# Altium project Kill_Board.PrjPcb
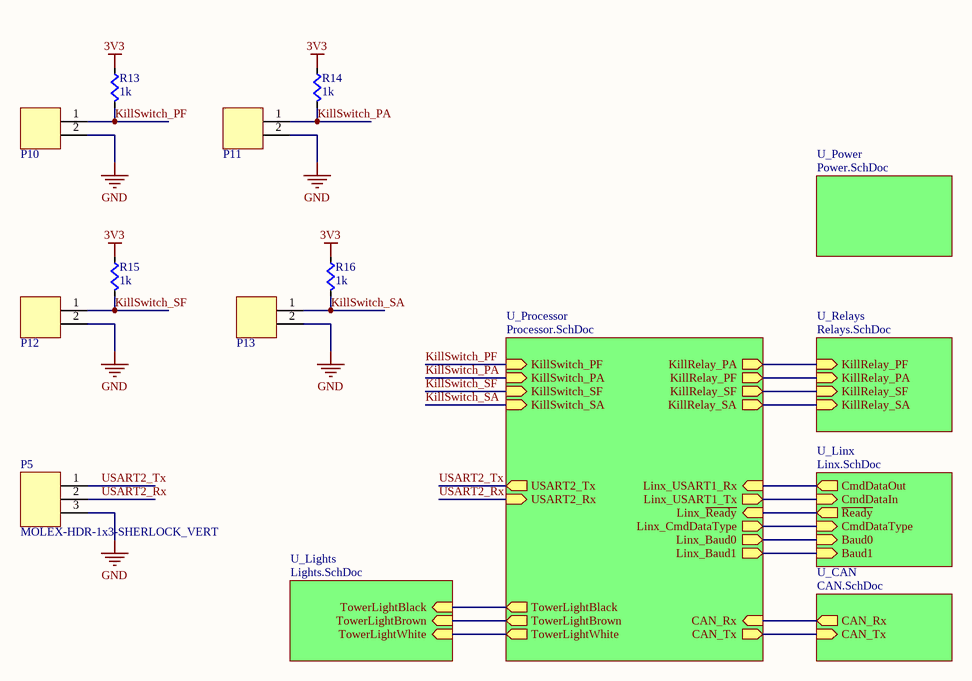
[diagram p0: Kill_Board_Top.SchDoc]
7 sheets, 86 parts. Net scope: hierarchical (ports join the sheet entries above them; power ports are global).
Board file: Kill_Board.PcbDoc
Sheets:
  Kill_Board_Top.SchDoc
    U_Processor = Processor.SchDoc
    U_Lights = Lights.SchDoc
    U_Power = Power.SchDoc
    U_CAN = CAN.SchDoc
    U_Relays = Relays.SchDoc
    U_Linx = Linx.SchDoc

## Sheet Kill_Board_Top.SchDoc
size A

### Parts
P5  MOLEX-HDR-1x3-SHERLOCK_VERT  [MOLEX-HDR-1X3-SHERLOCK-VERT]
P10  2-pin Horz Sherlock  [MOLEX-HDR-1X2-SHERLOCK-HORZ]  (value not drawn)
P11  2-pin Horz Sherlock  [MOLEX-HDR-1X2-SHERLOCK-HORZ]  (value not drawn)
P12  2-pin Horz Sherlock  [MOLEX-HDR-1X2-SHERLOCK-HORZ]  (value not drawn)
P13  2-pin Horz Sherlock  [MOLEX-HDR-1X2-SHERLOCK-HORZ]  (value not drawn)
R13  value 1k  [RES0603]  (hidden comment: Res)
R14  value 1k  [RES0603]  (hidden comment: Res)
R15  value 1k  [RES0603]  (hidden comment: Res)
R16  value 1k  [RES0603]  (hidden comment: Res)

### Sub-sheets
U_CAN = CAN.SchDoc: CAN_Rx (out), CAN_Tx (in)
U_Lights = Lights.SchDoc: TowerLightWhite (in), TowerLightBrown (in), TowerLightBlack (in)
U_Linx = Linx.SchDoc: ~{Ready} (out), CmdDataType (in), CmdDataOut (out), CmdDataIn (in), Baud0 (in), Baud1 (in)
U_Power = Power.SchDoc: no entries
U_Processor = Processor.SchDoc: KillSwitch_PF (in), TowerLightWhite (out), Linx_Baud1 (out), KillSwitch_PA (in), KillSwitch_SF (in), KillSwitch_SA (in), Linx_Baud0 (out), TowerLightBrown (out), TowerLightBlack (out), KillRelay_PF (out), KillRelay_PA (out), KillRelay_SF (out), KillRelay_SA (out), USART2_Rx (in), USART2_Tx (out), Linx_USART1_Rx (in), Linx_USART1_Tx (out), CAN_Rx (in), CAN_Tx (out), Linx_CmdDataType (out), Linx_~{Ready} (in)
U_Relays = Relays.SchDoc: KillRelay_PF (in), KillRelay_PA (in), KillRelay_SF (in), KillRelay_SA (in)

### Nets
3V3: R13.2(B) R14.2(B) R15.2(B) R16.2(B)
GND: P5.3 P10.2 P11.2 P12.2 P13.2
KillSwitch_PA: P11.1 R14.1(A) ; sheet U_Processor/KillSwitch_PA
KillSwitch_PF: P10.1 R13.1(A) ; sheet U_Processor/KillSwitch_PF
KillSwitch_SA: P13.1 R16.1(A) ; sheet U_Processor/KillSwitch_SA
KillSwitch_SF: P12.1 R15.1(A) ; sheet U_Processor/KillSwitch_SF
USART2_Rx: P5.2 ; sheet U_Processor/USART2_Rx
USART2_Tx: P5.1 ; sheet U_Processor/USART2_Tx
NetR1_1: sheet U_Processor/TowerLightBlack, sheet U_Lights/TowerLightBlack
NetR2_1: sheet U_Processor/TowerLightBrown, sheet U_Lights/TowerLightBrown
NetR3_1: sheet U_Processor/TowerLightWhite, sheet U_Lights/TowerLightWhite
NetR17_1: sheet U_Processor/KillRelay_PA, sheet U_Relays/KillRelay_PF
NetR18_1: sheet U_Processor/KillRelay_PF, sheet U_Relays/KillRelay_PA
NetR19_1: sheet U_Processor/KillRelay_SF, sheet U_Relays/KillRelay_SF
NetR20_1: sheet U_Processor/KillRelay_SA, sheet U_Relays/KillRelay_SA
NetU1_1: sheet U_Processor/CAN_Rx, sheet U_CAN/CAN_Rx
NetU1_4: sheet U_Processor/CAN_Tx, sheet U_CAN/CAN_Tx
NetU4_30: sheet U_Processor/Linx_USART1_Tx, sheet U_Linx/CmdDataIn
NetU4_31: sheet U_Processor/Linx_USART1_Rx, sheet U_Linx/CmdDataOut
NetU4_40: sheet U_Processor/Linx_~{Ready}, sheet U_Linx/~{Ready}
NetU4_41: sheet U_Processor/Linx_CmdDataType, sheet U_Linx/CmdDataType
NetU4_42: sheet U_Processor/Linx_Baud0, sheet U_Linx/Baud0
NetU4_43: sheet U_Processor/Linx_Baud1, sheet U_Linx/Baud1

### Library data of the parts
P5 = MOLEX-HDR-1x3-SHERLOCK_VERT: Header, Molex, 2mm Pitch Sherlock Header, Single Row, Vertical, 3 Circuits, Length 3.3mm, 0353620376; Supplier 1: Digi-Key; Supplier Part Number 1: WM18921-ND
P10-P13 = MOLEX-HDR-1x2-SHERLOCK_RA: Header, Molex, 2mm Pitch Sherlock Header, Single Row, Horizontal, 2 Circuits, Length 3.3mm,  0353630260; Manufacturer: Molex Inc; Manufacturer Part Number: 0353630260; Supplier Part Number 1: WM18931-ND; Supplier 1: Digi-Key
R13-R16 = Res: Supplier 1: Digi-Key; Supplier Part Number 1: RMCF0603JT10K0CT-ND

## Sheet Processor.SchDoc
size A
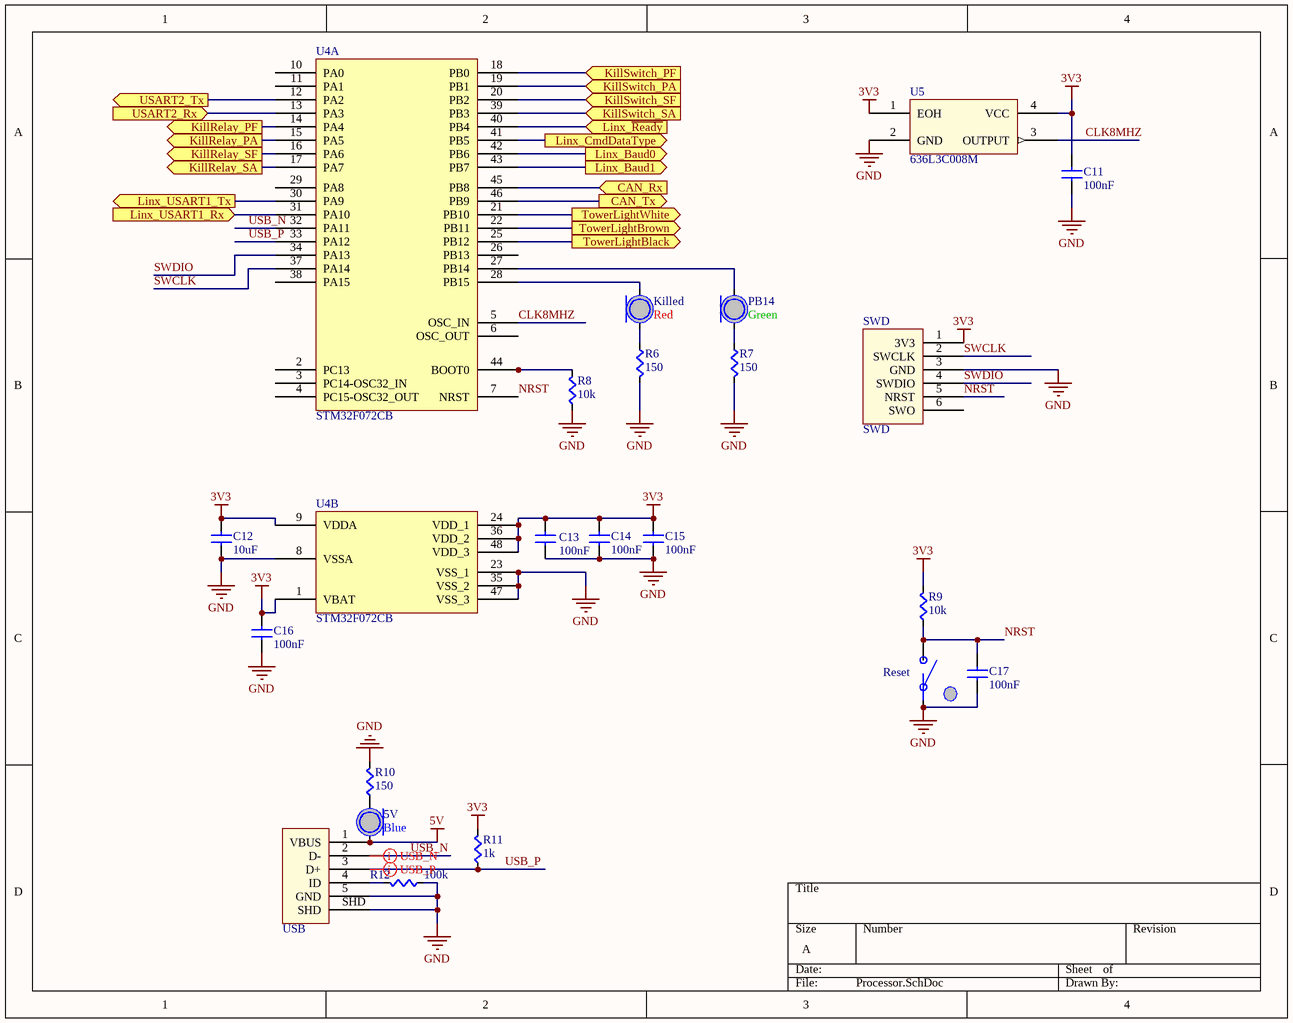
[diagram p1: Processor.SchDoc]

### Parts
5V  Color: Blue  [LED0603]  (hidden comment: LED)
C11  value 100nF  [CAPC0603]  (hidden comment: Cap)
C12  value 10uF  [CAPC0603]  (hidden comment: Cap)
C13  value 100nF  [CAPC0603]  (hidden comment: Cap)
C14  value 100nF  [CAPC0603]  (hidden comment: Cap)
C15  value 100nF  [CAPC0603]  (hidden comment: Cap)
C16  value 100nF  [CAPC0603]  (hidden comment: Cap)
C17  value 100nF  [CAPC0603]  (hidden comment: Cap)
Killed  Color: Red  [LED0603]  (hidden comment: LED)
PB14  Color: Green  [LED0603]  (hidden comment: LED)
R6  value 150  [RES0603]  (hidden comment: Res)
R7  value 150  [RES0603]  (hidden comment: Res)
R8  value 10k  [RES0603]  (hidden comment: Res)
R9  value 10k  [RES0603]  (hidden comment: Res)
R10  value 150  [RES0603]  (hidden comment: Res)
R11  value 1k  [RES0603]  (hidden comment: Res)
R12  value 100k  [RES0603]  (hidden comment: Res)
Reset  Button  [PTS645xxxxSMTR92]  (value not drawn)
SWD  SWD  [SWD_STM32]
U4  STM32F072CB  [STM32F072CB]  (parts A,B of 2)
U5  636L3C008M  [636L3C]
USB  USB Micro  [10118192-0001LF]  (value not drawn)

### Ports
CAN_Rx (in), CAN_Tx (out), KillRelay_PA (out), KillRelay_PF (out), KillRelay_SA (out), KillRelay_SF (out), KillSwitch_PA (in), KillSwitch_PF (in), KillSwitch_SA (in), KillSwitch_SF (in), Linx_Baud0 (out), Linx_Baud1 (out), Linx_CmdDataType (out), Linx_USART1_Rx (in), Linx_USART1_Tx (out), Linx_~{Ready} (in), TowerLightBlack (out), TowerLightBrown (out), TowerLightWhite (out), USART2_Rx (in), USART2_Tx (out)

### Nets
3V3: C11.1(A) C12.2(B) C13.1(A) C14.1(A) C15.1(A) C16.1(A) R9.1(A) R11.1(A) SWD.1(3V3) U4.1(VBAT) U4.9(VDDA) U4.24(VDD_1) U4.36(VDD_2) U4.48(VDD_3) U5.1(EOH) U5.4(VCC)
5V: 5V.A USB.1(VBUS)
GND: C11.2(B) C12.1(A) C13.2(B) C14.2(B) C15.2(B) C16.2(B) C17.2(B) R6.1(A) R7.1(A) R8.2(B) R10.1(A) R12.2(B) Reset.A SWD.3(GND) U4.8(VSSA) U4.23(VSS_1) U4.35(VSS_2) U4.47(VSS_3) U5.2(GND) USB.5(GND) USB.SHD
CLK8MHZ: U4.5(OSC_IN) U5.3(OUTPUT)
KillSwitch_PA: U4.19(PB1) ; port KillSwitch_PA
KillSwitch_PF: U4.18(PB0) ; port KillSwitch_PF
KillSwitch_SA: U4.39(PB3) ; port KillSwitch_SA
KillSwitch_SF: U4.20(PB2) ; port KillSwitch_SF
NRST: C17.1(A) R9.2(B) Reset.B SWD.5(NRST) U4.7(NRST)
SWCLK: SWD.2(SWCLK) U4.37(PA14)
SWDIO: SWD.4(SWDIO) U4.34(PA13)
USART2_Rx: U4.13(PA3) ; port USART2_Rx
USART2_Tx: U4.12(PA2) ; port USART2_Tx
USB_N: U4.32(PA11) USB.2(D-)
USB_P: R11.2(B) U4.33(PA12) USB.3(D+)
Net5V_C: 5V.C R10.2(B)
NetKilled_A: Killed.A U4.28(PB15)
NetKilled_C: Killed.C R6.2(B)
NetPB14_A: PB14.A U4.27(PB14)
NetPB14_C: PB14.C R7.2(B)
NetR1_1: U4.25(PB12) ; port TowerLightBlack
NetR2_1: U4.22(PB11) ; port TowerLightBrown
NetR3_1: U4.21(PB10) ; port TowerLightWhite
NetR8_1: R8.1(A) U4.44(BOOT0)
NetR12_1: R12.1(A) USB.4(ID)
NetR17_1: U4.15(PA5) ; port KillRelay_PA
NetR18_1: U4.14(PA4) ; port KillRelay_PF
NetR19_1: U4.16(PA6) ; port KillRelay_SF
NetR20_1: U4.17(PA7) ; port KillRelay_SA
NetU1_1: U4.45(PB8) ; port CAN_Rx
NetU1_4: U4.46(PB9) ; port CAN_Tx
NetU4_30: U4.30(PA9) ; port Linx_USART1_Tx
NetU4_31: U4.31(PA10) ; port Linx_USART1_Rx
NetU4_40: U4.40(PB4) ; port Linx_~{Ready}
NetU4_41: U4.41(PB5) ; port Linx_CmdDataType
NetU4_42: U4.42(PB6) ; port Linx_Baud0
NetU4_43: U4.43(PB7) ; port Linx_Baud1

Not connected (* = marked no-connect by the designer): SWD 6(SWO); U4 2(PC13) 3(PC14-OSC32_IN) 4(PC15-OSC32_OUT) 6(OSC_OUT) 10(PA0) 11(PA1) 26(PB13) 29(PA8) 38(PA15)

### Layout directives
differential pair: USB_N, USB_P

### Library data of the parts
Reset = Button: SPST Button; Supplier 1: Digi-Key; Supplier Part Number 1: CKN9087CT-ND
SWD = SWD_STM32: SWD connector matching the pinout on STM Discovery Boards
U4 = STM32F072CB: MCU 32BIT 128KB FLASH 48LQFP; Supplier 1: Digi-Key; Supplier Part Number 1: 497-14645-ND
U5 = 636L3C: HCMOS/TTL Clock Oscillator; Supplier 1: Digi-Key; Supplier Part Number 1: CTX1005CT-ND
USB = USB Micro: USB Mini B Metal Shield SMT; Supplier 1: Digi-Key; Supplier Part Number 1: 609-4613-1-ND
5V Killed PB14 = LED: Supplier 1: Digi-Key
  5V: Supplier Part Number 1: 754-1434-1-ND
  Killed: Supplier Part Number 1: 754-1122-1-ND
  PB14: Supplier Part Number 1: 754-1116-1-ND
C11-C17 = Cap: Supplier 1: Digi-Key; Supplier Part Number 1: 1276-1000-1-ND
R6-R12 = Res: Supplier 1: Digi-Key
  R6-R10: Supplier Part Number 1: RMCF0603JT10K0CT-ND
  R11: Supplier Part Number 1: RMCF0603JT1K00CT-ND
  R12: Supplier Part Number 1: RMCF0603JT100KCT-ND

## Sheet Lights.SchDoc
size A
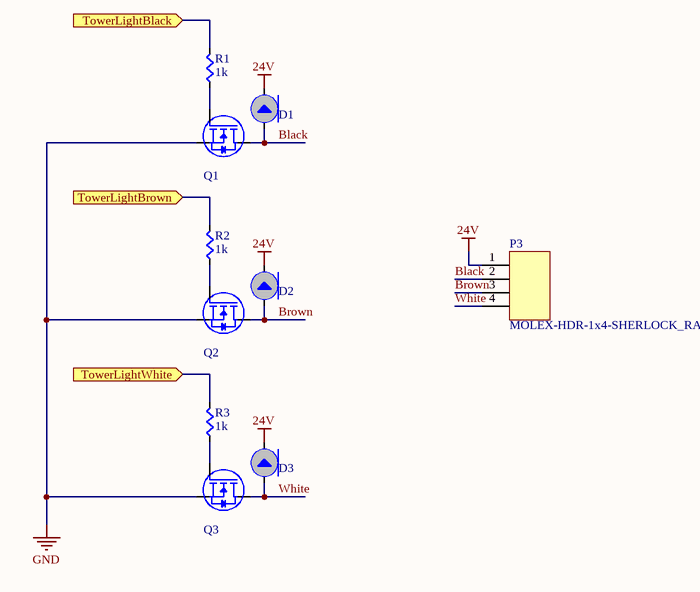
[diagram p2: Lights.SchDoc]

### Parts
D1  S1B-13-F  [SMASeries]  (value not drawn)
D2  S1B-13-F  [SMASeries]  (value not drawn)
D3  S1B-13-F  [SMASeries]  (value not drawn)
P3  MOLEX-HDR-1x4-SHERLOCK_RA  [MOLEX-HDR-1X4-SHERLOCK-RA]
Q1  BSN20-7  [SOT-323]  (value not drawn)
Q2  BSN20-7  [SOT-323]  (value not drawn)
Q3  BSN20-7  [SOT-323]  (value not drawn)
R1  value 1k  [RES0603]  (hidden comment: Res)
R2  value 1k  [RES0603]  (hidden comment: Res)
R3  value 1k  [RES0603]  (hidden comment: Res)

### Ports
TowerLightBlack (in), TowerLightBrown (in), TowerLightWhite (in)

### Nets
24V: D1.C D2.C D3.C P3.1
GND: Q1.2(S) Q2.2(S) Q3.2(S)
Black: D1.A P3.2 Q1.3(D)
Brown: D2.A P3.3 Q2.3(D)
White: D3.A P3.4 Q3.3(D)
NetQ1_1: Q1.1(G) R1.2(B)
NetQ2_1: Q2.1(G) R2.2(B)
NetQ3_1: Q3.1(G) R3.2(B)
NetR1_1: R1.1(A) ; port TowerLightBlack
NetR2_1: R2.1(A) ; port TowerLightBrown
NetR3_1: R3.1(A) ; port TowerLightWhite

### Library data of the parts
D1-D3 = Diode: Standard Diode Template; Supplier 1: Digi-Key; Supplier Part Number 1: S1B-FDICT-ND
P3 = MOLEX-HDR-1x4-SHERLOCK_RA: Header, Molex, 2mm Pitch Sherlock Header, Single Row, Horizontal, 4 Circuits, Length 3.3mm; Manufacturer Part Number: 0353630460; Supplier Part Number 1: WM18933-ND; Manufacturer: Molex; Supplier 1: Digikey
Q1-Q3 = NMOSFET: NMOSFET Template; Supplier 1: Digi-Key; Supplier Part Number 1: BSN20-7DICT-ND
R1-R3 = Res: Supplier 1: Digi-Key; Supplier Part Number 1: RMCF0603JT10K0CT-ND

## Sheet Power.SchDoc
size A
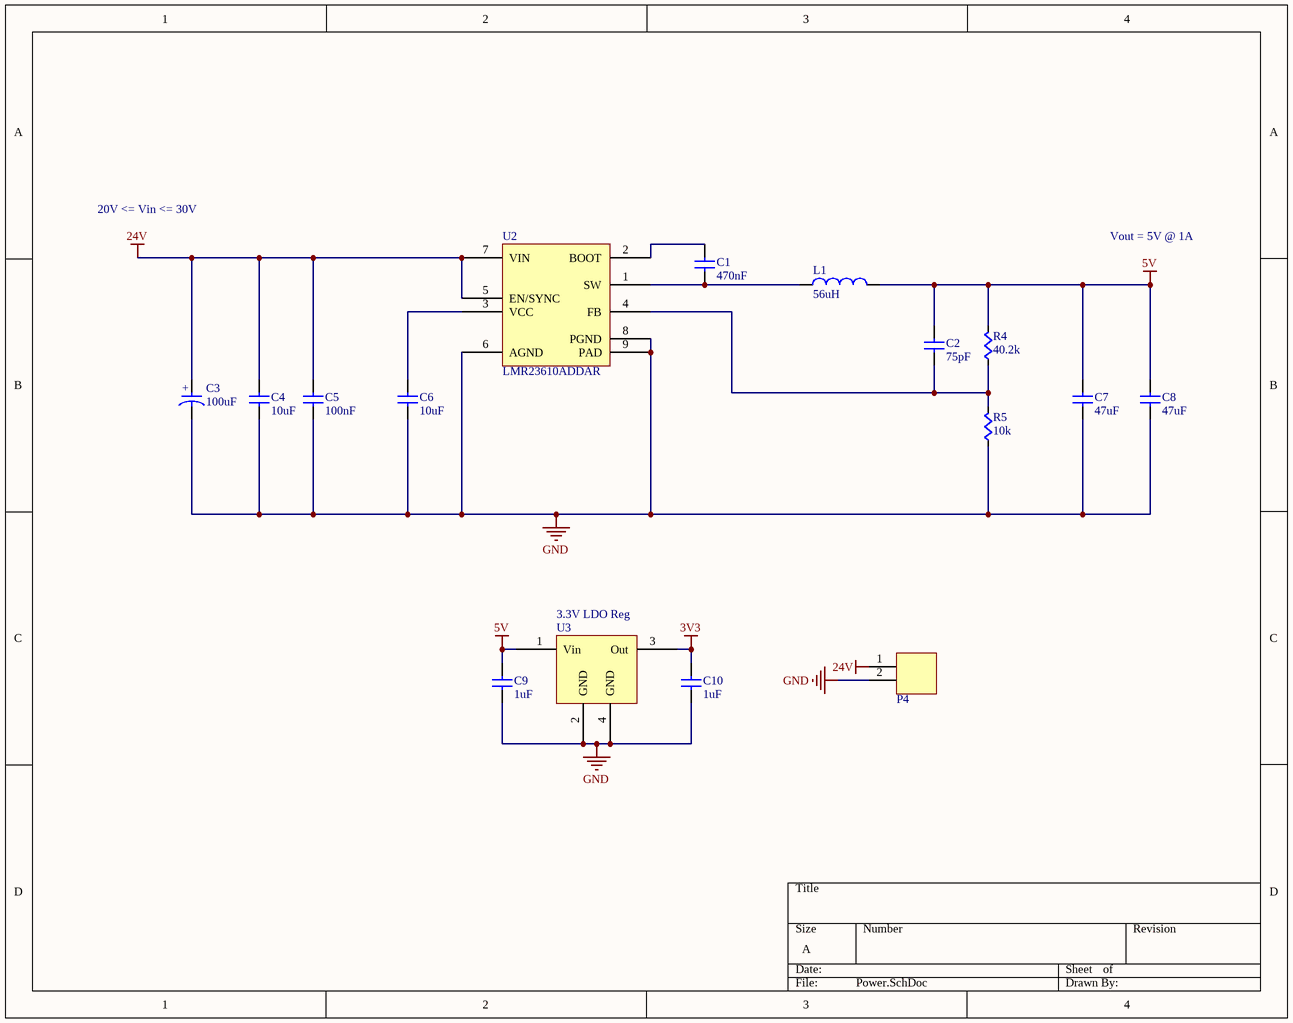
[diagram p3: Power.SchDoc]

### Parts
C1  value 470nF  [CAPC0603]  (hidden comment: Cap)
C2  value 75pF  [CAPC0603]  (hidden comment: Cap)
C3  value 100uF  [EEHZA1H101P]  (hidden comment: EEHZA1H101P)
C4  value 10uF  [CAP1210]  (hidden comment: Cap)
C5  value 100nF  [CAPC0603]  (hidden comment: Cap)
C6  value 10uF  [CAPC0603]  (hidden comment: Cap)
C7  value 47uF  [CAP1210]  (hidden comment: Cap)
C8  value 47uF  [CAP1210]  (hidden comment: Cap)
C9  value 1uF  [CAPC0603]  (hidden comment: Cap)
C10  value 1uF  [CAPC0603]  (hidden comment: Cap)
L1  value 56uH  [MSS1048-563MLB]  (hidden comment: MSS1048-563MLB)
P4  2-pin Vert Sherlock  [MOLEX-HDR-1X2-SHERLOCK-VERT]  (value not drawn)
R4  value 40.2k  [RES0603]  (hidden comment: Res)
R5  value 10k  [RES0603]  (hidden comment: Res)
U2  LMR23610ADDAR  [LMR23610ADDAR]
U3  3.3V LDO Reg  [SOT23-4n]

### Nets
3V3: C10.1(A) U3.3(Out)
5V: C2.1(A) C7.1(A) C8.1(A) C9.1(A) L1.2 R4.1(A) U3.1(Vin)
24V: C3.1 C4.1(A) C5.1(A) P4.1 U2.5(EN/SYNC) U2.7(VIN)
GND: C3.2 C4.2(B) C5.2(B) C6.2(B) C7.2(B) C8.2(B) C9.2(B) C10.2(B) P4.2 R5.2(B) U2.6(AGND) U2.8(PGND) U2.9(PAD) U3.2(GND) U3.4(GND)
NetC1_1: C1.1(A) U2.2(BOOT)
NetC1_2: C1.2(B) L1.1 U2.1(SW)
NetC2_2: C2.2(B) R4.2(B) R5.1(A) U2.4(FB)
NetC6_1: C6.1(A) U2.3(VCC)

### Notes on the sheet
- 20V <= Vin <= 30V
- Vout = 5V @ 1A
- (in symbol EEHZA1H101P) +

### Library data of the parts
C3 = EEHZA1H101P: CAP ALUM POLY HYB 100UF 50V SMD; Manufacturer 1: Panasonic; Tolerance: 20%; Supplier 1: Digi-Key; Supplier Part Number 1: P15442CT-ND; Manufacturer Part Number 1: EEHZA1H101P; Voltage: 50V; ComponentLink1URL: https://na.industrial.panasonic.com/products/capacitors/aluminum-electrolytic-capacitors/conductive-polymer-hybrid-aluminum-electrolytic/series/za-high-temp-reflow/ABA0135/model/EEHZA1H101P; ComponentLink1Description: Web Site; ComponentLink2URL: https://industrial.panasonic.com/cdbs/www-data/pdf/RDD0000/ABA0000C1221.pdf; ComponentLink2Description: Data Sheet; ComponentLink3URL: https://industrial.panasonic.com/cdbs/www-data/pdf/RDD0000/ABA0000COS44.pdf; ComponentLink3Description: ZA Series Technical Data
L1 = MSS1048-563MLB: FIXED IND 56UH 1.7A 126 MOHM; Manufacturer 1: Coilcraft; Manufacturer Part Number 1: MSS1048-563MLB; ComponentLink1Description: Web Site; ComponentLink1URL: https://www.coilcraft.com/mss1048.cfm; Supplier 1: Coilcraft; Supplier Part Number 1: MSS1048-563MLB
P4 = MOLEX-HDR-1x2-SHERLOCK_VERT: Header, Molex, 2mm Pitch Sherlock Header, Single Row, Vertical, 2 Circuits, Length 3.3mm, 0353620250; Supplier Part Number 1: WM18920-ND; Supplier 1: Digi-Key
U2 = LMR23610ADDAR: IC REG BUCK ADJ 1A SYNC 8SOPWRPD; Manufacturer 1: Texas Instruments; Supplier 1: Digi-Key; Supplier Part Number 1: 296-47267-1-ND; Manufacturer Part Number 1: LMR23610ADDAR; ComponentLink1URL: http://www.ti.com/lit/ds/symlink/lmr23610.pdf; ComponentLink1Description: Datasheet; ComponentLink2URL: http://www.ti.com/product/LMR23610/description; ComponentLink2Description: Web Site
U3 = LM3940IMPX-3.3: IC REG LDO 3.3V 1A SOT223; Supplier 1: Digi-Key; Supplier Part Number 1: LM3940IMPX-3.3/NOPBCT-ND
C1 C2 C4-C10 = Cap: Supplier 1: Digi-Key; Supplier Part Number 1: 1276-1000-1-ND
R4 R5 = Res: Supplier 1: Digi-Key; Supplier Part Number 1: RMCF0603JT10K0CT-ND

## Sheet CAN.SchDoc
size A
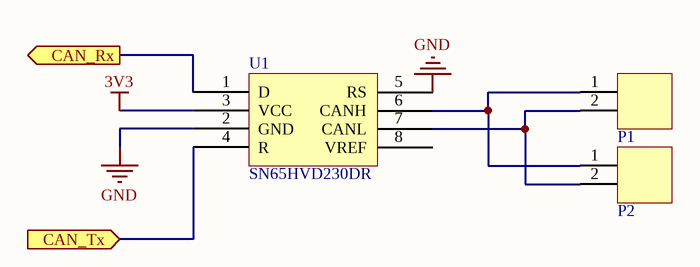
[diagram p4: CAN.SchDoc]

### Parts
P1  2-pin Horz Sherlock  [MOLEX-HDR-1X2-SHERLOCK-HORZ]  (value not drawn)
P2  2-pin Horz Sherlock  [MOLEX-HDR-1X2-SHERLOCK-HORZ]  (value not drawn)
U1  SN65HVD230DR  [SOIC-8pin]

### Ports
CAN_Rx (out), CAN_Tx (in)

### Nets
3V3: U1.3(VCC)
GND: U1.2(GND) U1.5(RS)
NetP1_1: P1.1 P2.1 U1.6(CANH)
NetP1_2: P1.2 P2.2 U1.7(CANL)
NetU1_1: U1.1(D) ; port CAN_Rx
NetU1_4: U1.4(R) ; port CAN_Tx

Not connected (* = marked no-connect by the designer): U1 8(VREF)

### Library data of the parts
P1 P2 = MOLEX-HDR-1x2-SHERLOCK_RA: as P10 on sheet Kill_Board_Top; Manufacturer Part Number: 0353630260; Supplier Part Number 1: WM18931-ND; Supplier 1: Digi-Key
U1 = SN65HVD230DR: IC TXRX CAN 1MBPS 3.3V 8SOIC; Supplier 1: Digi-Key; Supplier Part Numbe 1: 296-11654-1-ND

## Sheet Relays.SchDoc
size A
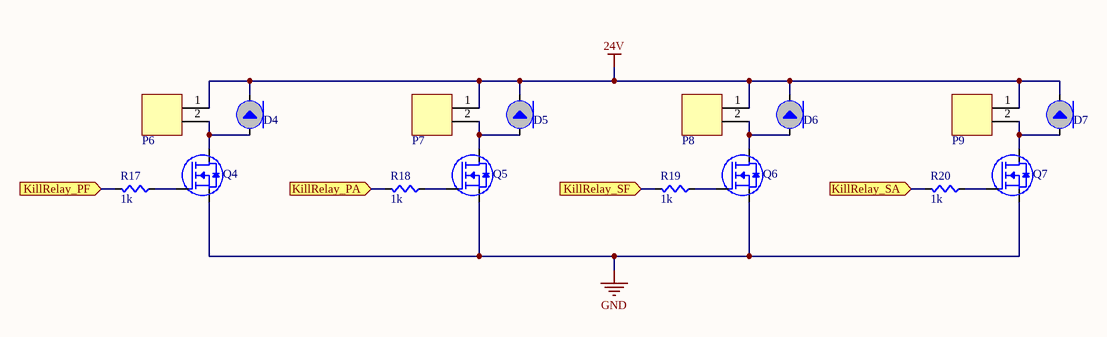
[diagram p5: Relays.SchDoc]

### Parts
D4  S1B-13-F  [SMASeries]  (value not drawn)
D5  S1B-13-F  [SMASeries]  (value not drawn)
D6  S1B-13-F  [SMASeries]  (value not drawn)
D7  S1B-13-F  [SMASeries]  (value not drawn)
P6  2-pin Horz Sherlock  [MOLEX-HDR-1X2-SHERLOCK-HORZ]  (value not drawn)
P7  2-pin Horz Sherlock  [MOLEX-HDR-1X2-SHERLOCK-HORZ]  (value not drawn)
P8  2-pin Horz Sherlock  [MOLEX-HDR-1X2-SHERLOCK-HORZ]  (value not drawn)
P9  2-pin Horz Sherlock  [MOLEX-HDR-1X2-SHERLOCK-HORZ]  (value not drawn)
Q4  BSN20-7  [SOT-323]  (value not drawn)
Q5  BSN20-7  [SOT-323]  (value not drawn)
Q6  BSN20-7  [SOT-323]  (value not drawn)
Q7  BSN20-7  [SOT-323]  (value not drawn)
R17  value 1k  [RES0603]  (hidden comment: Res)
R18  value 1k  [RES0603]  (hidden comment: Res)
R19  value 1k  [RES0603]  (hidden comment: Res)
R20  value 1k  [RES0603]  (hidden comment: Res)

### Ports
KillRelay_PA (in), KillRelay_PF (in), KillRelay_SA (in), KillRelay_SF (in)

### Nets
24V: D4.C D5.C D6.C D7.C P6.1 P7.1 P8.1 P9.1
GND: Q4.2(S) Q5.2(S) Q6.2(S) Q7.2(S)
NetD4_A: D4.A P6.2 Q4.3(D)
NetD5_A: D5.A P7.2 Q5.3(D)
NetD6_A: D6.A P8.2 Q6.3(D)
NetD7_A: D7.A P9.2 Q7.3(D)
NetQ4_1: Q4.1(G) R17.2(B)
NetQ5_1: Q5.1(G) R18.2(B)
NetQ6_1: Q6.1(G) R19.2(B)
NetQ7_1: Q7.1(G) R20.2(B)
NetR17_1: R17.1(A) ; port KillRelay_PF
NetR18_1: R18.1(A) ; port KillRelay_PA
NetR19_1: R19.1(A) ; port KillRelay_SF
NetR20_1: R20.1(A) ; port KillRelay_SA

### Library data of the parts
D4-D7 = Diode: Standard Diode Template; Supplier 1: Digi-Key; Supplier Part Number 1: S1B-FDICT-ND
P6-P9 = MOLEX-HDR-1x2-SHERLOCK_RA: as P10 on sheet Kill_Board_Top; Manufacturer Part Number: 0353630260; Supplier Part Number 1: WM18931-ND; Supplier 1: Digi-Key
Q4-Q7 = NMOSFET: NMOSFET Template; Supplier 1: Digi-Key; Supplier Part Number 1: BSN20-7DICT-ND
R17-R20 = Res: Supplier 1: Digi-Key; Supplier Part Number 1: RMCF0603JT10K0CT-ND

## Sheet Linx.SchDoc
size A
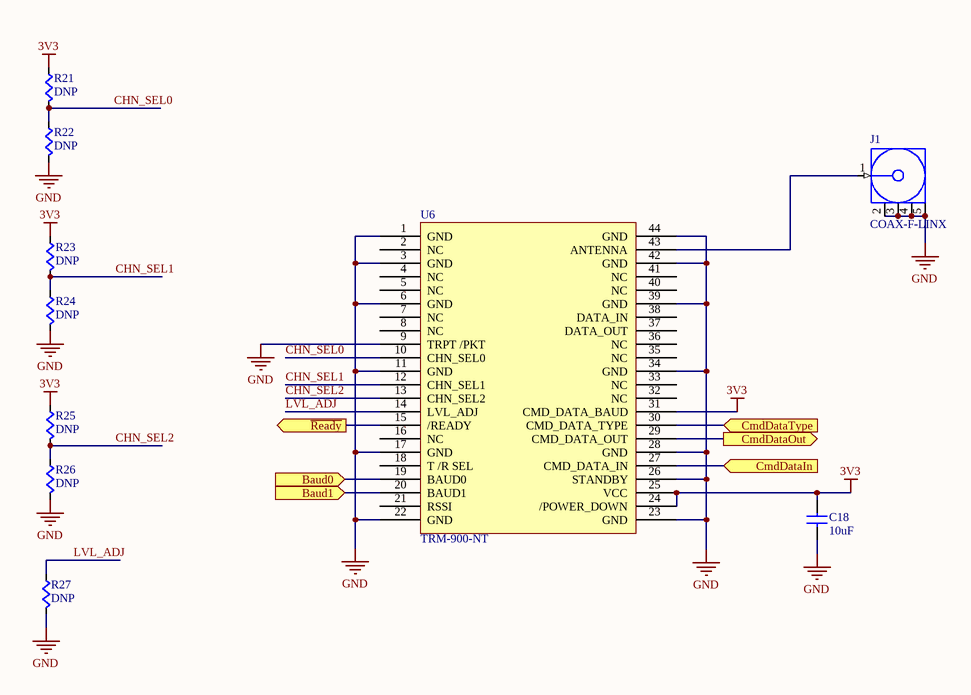
[diagram p6: Linx.SchDoc]

### Parts
C18  value 10uF  [CAPC0603]  (hidden comment: Cap)
J1  COAX-F-LINX  [MCX5.08-H5-EDITED]
R21  value DNP  [RES0603]  (hidden comment: Res)
R22  value DNP  [RES0603]  (hidden comment: Res)
R23  value DNP  [RES0603]  (hidden comment: Res)
R24  value DNP  [RES0603]  (hidden comment: Res)
R25  value DNP  [RES0603]  (hidden comment: Res)
R26  value DNP  [RES0603]  (hidden comment: Res)
R27  value DNP  [RES0603]  (hidden comment: Res)
U6  TRM-900-NT  [TRM-900-NT]

### Ports
Baud0 (in), Baud1 (in), CmdDataIn (in), CmdDataOut (out), CmdDataType (in), ~{Ready} (out)

### Nets
3V3: C18.1(A) R21.2(B) R23.2(B) R25.2(B) U6.24(/POWER_DOWN) U6.25(VCC) U6.31(CMD_DATA_BAUD)
GND: C18.2(B) J1.2(GND) J1.3(GND) J1.4(GND) J1.5(GND) R22.1(A) R24.1(A) R26.1(A) R27.1(A) U6.1(GND) U6.3(GND) U6.6(GND) U6.9(TRPT_/PKT) U6.11(GND) U6.17(GND) U6.22(GND) U6.23(GND) U6.26(STANDBY) U6.28(GND) U6.34(GND) U6.39(GND) U6.42(GND) U6.44(GND)
CHN_SEL0: R21.1(A) R22.2(B) U6.10(CHN_SEL0)
CHN_SEL1: R23.1(A) R24.2(B) U6.12(CHN_SEL1)
CHN_SEL2: R25.1(A) R26.2(B) U6.13(CHN_SEL2)
LVL_ADJ: R27.2(B) U6.14(LVL_ADJ)
NetJ1_1: J1.1(Signal) U6.43(ANTENNA)
NetU4_30: U6.27(CMD_DATA_IN) ; port CmdDataIn
NetU4_31: U6.29(CMD_DATA_OUT) ; port CmdDataOut
NetU4_40: U6.15(/READY) ; port ~{Ready}
NetU4_41: U6.30(CMD_DATA_TYPE) ; port CmdDataType
NetU4_42: U6.19(BAUD0) ; port Baud0
NetU4_43: U6.20(BAUD1) ; port Baud1

Not connected (* = marked no-connect by the designer): U6 2(NC) 4(NC) 5(NC) 7(NC) 8(NC) 16(NC) 18(T_/R_SEL) 21(RSSI) 32(NC) 33(NC) 35(NC) 36(NC) 37(DATA_OUT) 38(DATA_IN) 40(NC) 41(NC)

### Library data of the parts
J1 = COAX-F-LINX: RF Coaxial PCB Connector, MCX; Thru-Hole, Right-Angle Mount Socket, Blunt Post Terminal, 50 Ohm Impedance, Edited for 0.2mm larger holes; Supplier 1: Digi-Key; Supplier Part Number 1: *
U6 = TRM-900-NT: RF TXRX MODULE ISM<1GHZ; Manufacturer 1: Linx; Supplier 1: Digi-Key; Supplier Part Number 1: TRM-900-NT-ND; Manufacturer Part Number 1: TRM-900-NT
C18 = Cap: Supplier 1: Digi-Key; Supplier Part Number 1: 1276-1000-1-ND
R21-R27 = Res: Supplier 1: Digi-Key; Supplier Part Number 1: 311-0.0GRCT-ND

## Nets that join several sheets
3V3: Kill_Board_Top (R13.2 R14.2 R15.2 R16.2), Processor (16 pins), Power (C10.1 U3.3), CAN (U1.3), Linx (7 pins)
5V: Processor (5V.A USB.1), Power (7 pins)
24V: Lights (D1.C D2.C D3.C P3.1), Power (6 pins), Relays (8 pins)
GND: Kill_Board_Top (5 pins), Processor (21 pins), Lights (Q1.2 Q2.2 Q3.2), Power (15 pins), CAN (U1.2 U1.5), Relays (Q4.2 Q5.2 Q6.2 Q7.2), Linx (23 pins)
KillSwitch_PA: Kill_Board_Top (P11.1 R14.1), Processor (U4.19)
KillSwitch_PF: Kill_Board_Top (P10.1 R13.1), Processor (U4.18)
KillSwitch_SA: Kill_Board_Top (P13.1 R16.1), Processor (U4.39)
KillSwitch_SF: Kill_Board_Top (P12.1 R15.1), Processor (U4.20)
NetR1_1: Processor (U4.25), Lights (R1.1)
NetR2_1: Processor (U4.22), Lights (R2.1)
NetR3_1: Processor (U4.21), Lights (R3.1)
NetR17_1: Processor (U4.15), Relays (R17.1)
NetR18_1: Processor (U4.14), Relays (R18.1)
NetR19_1: Processor (U4.16), Relays (R19.1)
NetR20_1: Processor (U4.17), Relays (R20.1)
NetU1_1: Processor (U4.45), CAN (U1.1)
NetU1_4: Processor (U4.46), CAN (U1.4)
NetU4_30: Processor (U4.30), Linx (U6.27)
NetU4_31: Processor (U4.31), Linx (U6.29)
NetU4_40: Processor (U4.40), Linx (U6.15)
NetU4_41: Processor (U4.41), Linx (U6.30)
NetU4_42: Processor (U4.42), Linx (U6.19)
NetU4_43: Processor (U4.43), Linx (U6.20)
USART2_Rx: Kill_Board_Top (P5.2), Processor (U4.13)
USART2_Tx: Kill_Board_Top (P5.1), Processor (U4.12)